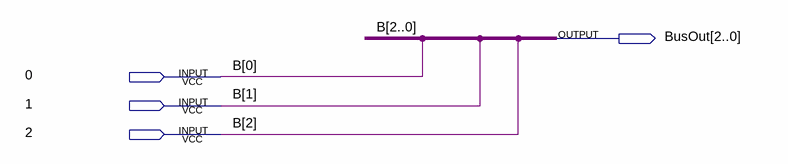
[diagram p0: schematic sheet]
// Quartus schematic BusConnector.bdf as structural Verilog: 0 symbols, 4 pins
module BusConnector (
  input  \0 ,
  input  \1 ,
  input  \2 ,
  output [2:0] BusOut
);


  assign BusOut = {\2 , \1 , \0 };

  // Other names for the same wires on the sheet: B[2:0] = {\2 , \1 , \0 }
endmodule
